# EasyEDA Pro project ProProject_nRF52840无线键盘_2024-02-15.epro, board PCB5
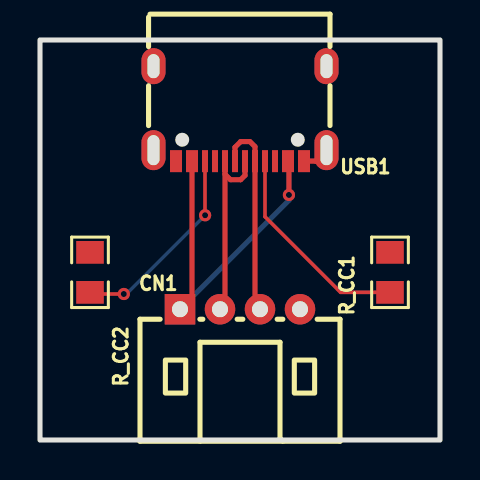
[diagram p16: board, top side]
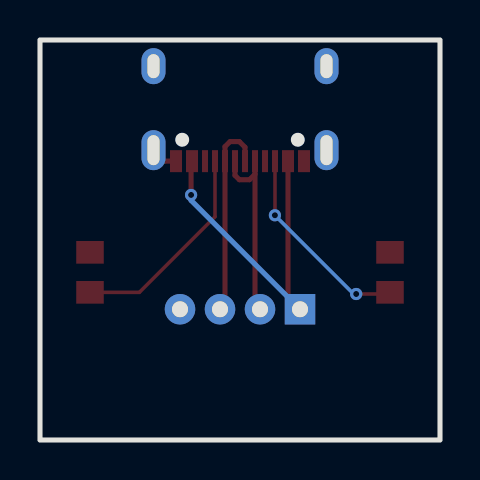
[diagram p17: board, bottom side, seen from below]

Outline 20 x 20 mm; copper layers: Top Layer, Bottom Layer. Coordinates in mm from the lower left corner of the outline.
Outline path: rectangle 0,20 20,0
Stack: Top Layer 0.035mm / Dielectric1 1.51mm FR4 er 4.5 / Bottom Layer 0.035mm

## Design rules (mm)
template: JLCPCB Capability(Two Layers Board)
spacing copperThickness1oz (default): track to track 0.102, other pairs 0.152 to 0.3
spacing copperThickness2oz: track to track 0.203, other pairs 0.152 to 0.3
track width copperThickness1oz (default): min 0.127, default 0.254, max 2.54
track width copperThickness2oz: min 0.203, default 0.254, max 2.54
differential pair differentialPair (default): width min 0.127, default 0.254, max 2.54; gap min 0.152, default 0.152
via viaSize (default): diameter min 0.5, default 0.61, max 10; hole min 0.3, default 0.305, max 6.3

## Placement (name value [footprint] x y rotation side)
CN1  HDGC2001WR-4P  [CONN-TH_4P-P2.00_HDGC_HDGC2001WR-4P]  10 6.54 0 top
R_CC1  5.1kΩ  [R0805]  17.5 8.38 90 top
R_CC2  5.1kΩ  [R0805]  2.5 8.38 270 top
USB1  TYPE-C 16PIN 2MD(073)  [USB-C-SMD_TYPE-C-6PIN-2MD-073]  10 16.32 180 top

## Footprints (pads in the part's own frame, mm; a bottom-side part is the same pattern mirrored in y, then rotated)
CONN-TH_4P-P2.00_HDGC_HDGC2001WR-4P
  rect 1.524x1.524 hole 0.8: 1(-3,0)
  round 1.524 hole 0.8: 2(-1,0) 3(1,0) 4(3,0)
R0805
  rect 1.133x1.377 smd: 1(-1,0) 2(1,0)
USB-C-SMD_TYPE-C-6PIN-2MD-073
  rect 0.6x1.1 smd: 1(-3.2,2.375) 2(-2.4,2.375) 11(2.4,2.375) 12(3.2,2.375)
  rect 0.3x1.1 smd: 3(-1.75,2.375) 4(-1.25,2.375) 5(-0.75,2.375) 6(-0.25,2.375) 7(0.25,2.375) 8(0.75,2.375) 9(1.25,2.375) 10(1.75,2.375)
  oval 1.2x2 hole 0.6x1.5: 13(-4.325,1.825) 14(4.325,1.825)
  oval 1.2x1.8 hole 0.6x1.2: 13(-4.325,-2.375) 14(4.325,-2.375)

## Nets
As in the schematic.

Pads without a net: USB1 3 9

## Via types
v1: diameter 0.61, hole 0.305, Top Layer to Bottom Layer, 3 vias

## Routing (per net, layer and track width the routed paths; a pad name or vN(x,y) marks a point on that pad's centre or on a via; arc(x,y) is an arc through that point)
GND: length 1.4
  Top Layer w0.254: USB1.1 13.78,13.94 USB1.13
VBUS: length 17.3
  Top Layer w0.254: USB1.11 7.6,7.14 CN1.1 ; v1(12.45,12.25) 12.45,13.9 USB1.2
  Bottom Layer w0.254: CN1.1 12.45,11.98 v1(12.45,12.25)
D+: length 9.4
  Top Layer w0.254: USB1.6 10.25,13.23 10.03,13.02 9.53,13.02 9.25,13.29 ; USB1.8 9.25,13.29 ; 9.25,13.29 9.25,6.79 CN1.2
D-: length 10.1
  Top Layer w0.254: USB1.7 9.75,14.64 10.03,14.92 10.5,14.92 10.75,14.67 USB1.5 10.75,6.79 CN1.3
$1N227: length 10.6
  Top Layer w0.178: R_CC1.1 15.03,7.38 11.25,11.16 USB1.4
$1N228: length 10.1
  Top Layer w0.178: USB1.10 8.25,11.24 v1(8.25,11.24) ; R_CC2.2 2.58,7.3 v1(4.19,7.3)
  Bottom Layer w0.178: v1(8.25,11.24) 4.32,7.3 v1(4.19,7.3)

## Copper pours and planes (outline as drawn; the poured copper is in the pictures)
GND on Top Layer: -27.31,31.18 25.02,31.18 25.02,-13.27 -27.31,-13.27
GND on Bottom Layer: -7.75,24.95 39.75,24.95 39.75,-28.13 -7.75,-28.13
